# Altium project AUT2606_Semester_Prosjekt.PrjPcb
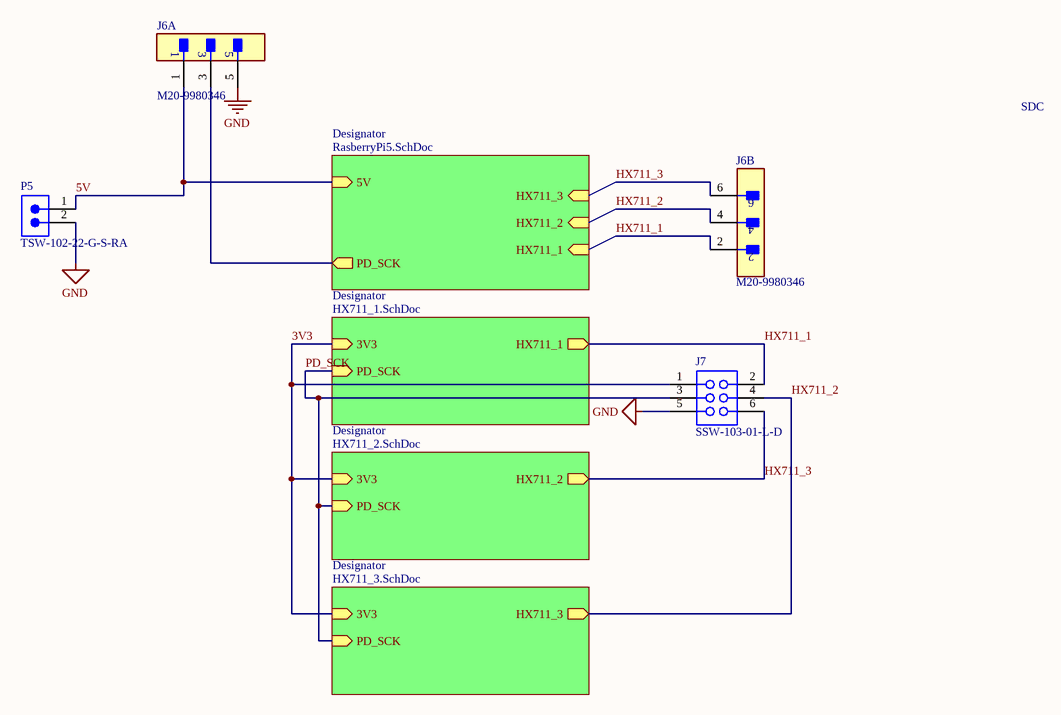
[diagram p0: Main.SchDoc]
5 sheets, 70 parts. Net scope: hierarchical (ports join the sheet entries above them; power ports are global).
Board files: RobotArm_Olav_Nikolai.PcbDoc, RobotArm_HX711_Olav_Nikolai.PcbDoc
Sheets:
  Main.SchDoc
    Designator = RasberryPi5.SchDoc
    Designator = HX711_1.SchDoc
    Designator = HX711_2.SchDoc
    Designator = HX711_3.SchDoc

## Sheet Main.SchDoc
size A4; SheetNumber: 1; SheetTotal: 5

### Parts
J6  M20-9980346  [FP-M20-9980346-MFG]  (parts A,B of 2)
J7  SSW-103-01-L-D  [SMTC-SSW-103-01-X-D]
P5  TSW-102-22-G-S-RA  [SMTC-TSW-102-22-X-S-RA]

### Sub-sheets
Designator = RasberryPi5.SchDoc: 5V (in), HX711_1 (in), HX711_2 (in), HX711_3 (in), PD_SCK (out)
Designator = HX711_1.SchDoc: 3V3 (in), HX711_1 (out), PD_SCK (in)
Designator = HX711_2.SchDoc: 3V3 (in), HX711_2 (out), PD_SCK (in)
Designator = HX711_3.SchDoc: 3V3 (in), HX711_3 (out), PD_SCK (in)

### Nets
GND: J6.5 J7.5 P5.2
3V3: J7.1 ; sheet Designator/3V3, sheet Designator/3V3, sheet Designator/3V3
5V: J6.1 P5.1 ; sheet Designator/5V
HX711_1: J6.2 J7.2 ; sheet Designator/HX711_1, sheet Designator/HX711_1
HX711_2: J6.4 J7.4 ; sheet Designator/HX711_2, sheet Designator/HX711_3
HX711_3: J6.6 J7.6 ; sheet Designator/HX711_3, sheet Designator/HX711_2
PD_SCK: J7.3 ; sheet Designator/PD_SCK, sheet Designator/PD_SCK, sheet Designator/PD_SCK
NetJ6_3: J6.3 ; sheet Designator/PD_SCK

### Notes on the sheet
- SDC

### Library data of the parts
J6 = CMP-2000-06636-2: CONN HEADER VERT 6POS 2.54MM; Manufacturer: Harwin; Current Rating: 3A; Number Of Contacts: 6; Conn Gender: Male; Conn Orientation: Vertical; Device Class L1: Connectors; ComponentLink2Description: Datasheet; Height: 8.99mm; Temperature Range High: +105°C; Contact Material: Tin,Nickel; RoHS: TRUE; Temperature Range Low: -40°C; ComponentLink2URL: https://cdn.harwin.com/pdfs/M20-998.pdf; Digikey Description: CONN HEADER VERT 6POS 2.54MM; Pitch: 2.54mm; Package: M20-9980346; Device Class L2: Headers and Wire Housings; Manufacturer Part Number: M20-9980346; Number Of Rows: 2; Category: Conn; Lead Free: Yes; Mouser Description: 2.54mm (0.1") Pitch DIL Vertical PC Tail Pin Header, 6.1mm mating pin height, tin, 3+3 contacts; Temperature: -40°C to +105°C; Device Class L3: unset; Octopart: https://octopart.com/m20-9980346-harwin-5436545; Automotive: No
J7 = CMP-1023-00330-1: SQ Post Socket, Through-hole, Vertical, -55 to 125 degC, 2.54 mm Pitch, 6-Pin, Female, RoHS; Manufacturer: Samtec; Pitch: 2.54 mm; ComponentLink3Description: Package Specification; DatasheetVersion: F-214; Mounting Technology: Through-hole; RoHS: True; PackageDescription: Assembly, Socket Strip .016 X .031 Tail; Temperature Range: -55 to 125 degC; ComponentLink1Description: Manufacturer URL; ComponentLink2Description: Datasheet; ComponentLink3URL: http://www.samtec.com/documents/webfiles/cpdf/SSW-1XX-XX-XXX-X-XX-XXX-XX-MKT.pdf; ComponentLink2URL: http://www.samtec.com/documents/webfiles/pdf/SSW_TH.PDF; Orientation: Vertical; PartNumber: SSW-103-01-L-D; PackageReference: SSW-103-01-X-D; PackageVersion: CA, 6/1987; ComponentLink1URL: http://www.samtec.com
P5 = CMP-1024-00323-1: 0.025" SQ Post Header, Through-hole, Right Angle, -55 to 125 degC, 2.54 mm Pitch, 2-Pin, Male, RoHS; Manufacturer: Samtec; Pitch: 2.54 mm; ComponentLink2URL: http://www.samtec.com/documents/webfiles/pdf/TSW_TH.PDF; PackageVersion: DM, 8/1988; PartNumber: TSW-102-22-G-S-RA; ComponentLink1URL: http://www.samtec.com; ComponentLink3URL: http://www.samtec.com/documents/webfiles/cpdf/TSW-XXX-XX-XXX-X-XX-XXX-MKT.pdf; Mounting Technology: Through-hole; DatasheetVersion: F-214; Temperature Range: -55 to 125 degC; PackageDescription: .025[0.64] SQ. Post Terminal Strip Assembly; ComponentLink2Description: Datasheet; ComponentLink3Description: Package Specification; PackageReference: TSW-102-22-X-S-RA; ComponentLink1Description: Manufacturer URL; RoHS: True; Orientation: Right Angle

## Sheet RasberryPi5.SchDoc
size A4; SheetNumber: 2; SheetTotal: 5
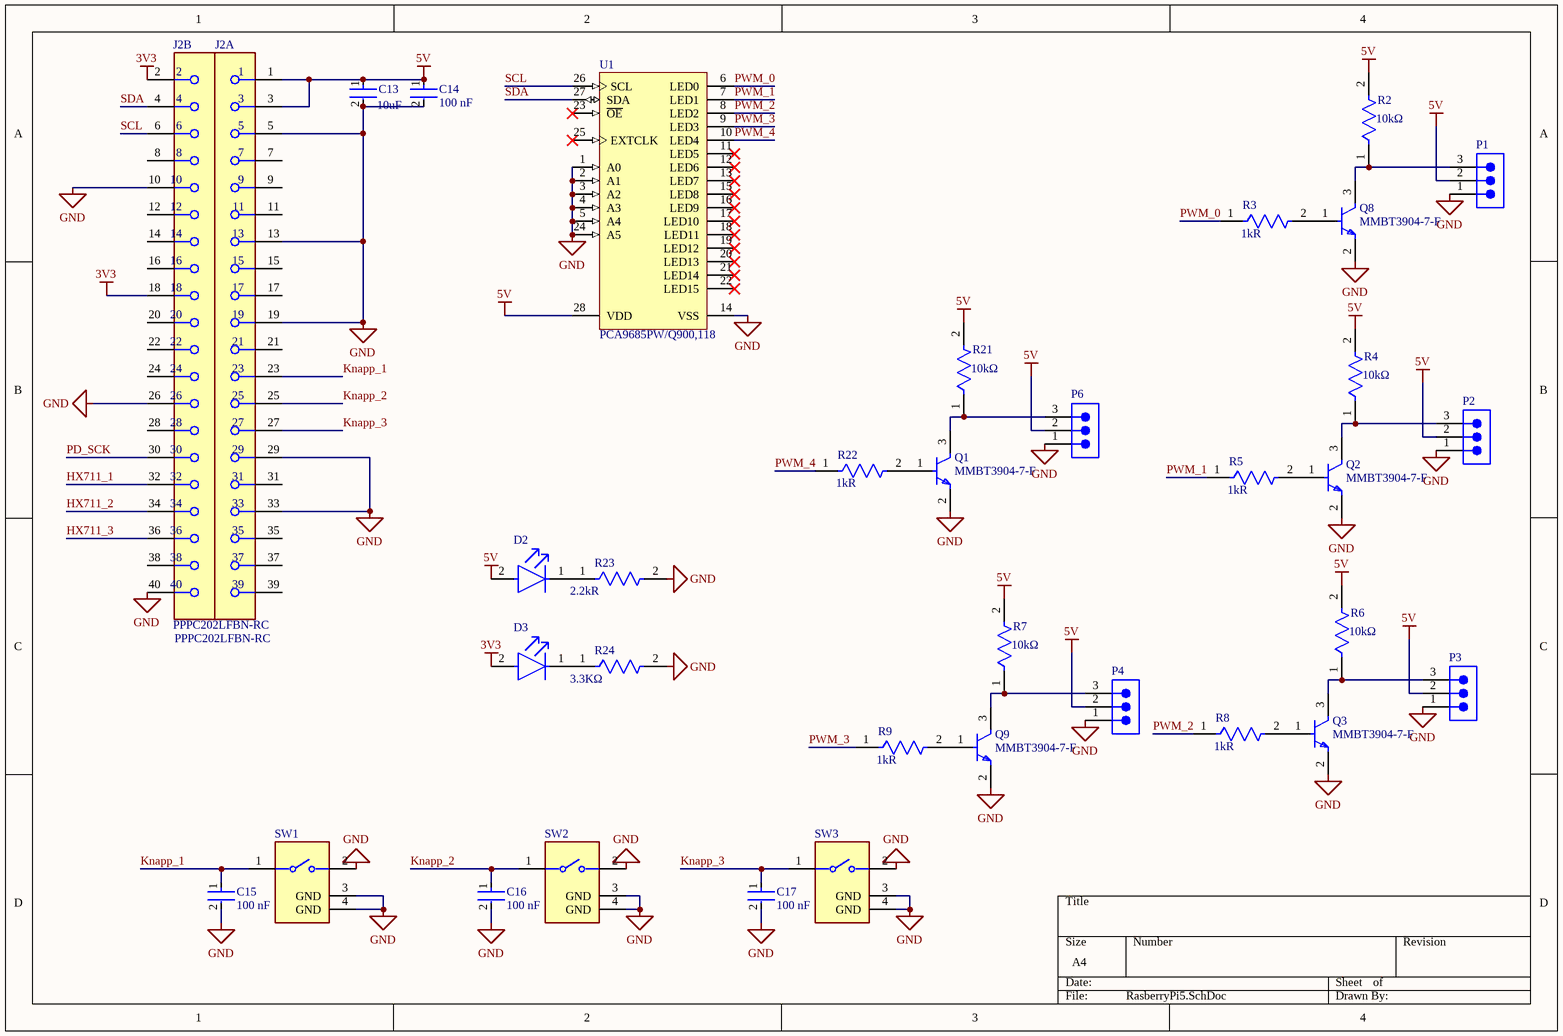
[diagram p1: RasberryPi5.SchDoc]

### Parts
C13  value 10uF  [FP-GRM18-0_15-MFG]  (hidden comment: GRM188R61A106KE69D)
C14  100 nF  [FP-CC0603-DA-MFG]
C15  100 nF  [FP-CC0603-DA-MFG]
C16  100 nF  [FP-CC0603-DA-MFG]
C17  100 nF  [FP-CC0603-DA-MFG]
D2  LTST-C193KGKT-5A  [FP-LTST-C193KGKT-5A-MFG]  (value not drawn)
D3  LTST-C193KGKT-5A  [FP-LTST-C193KGKT-5A-MFG]  (value not drawn)
J2  PPPC202LFBN-RC  [FP-PPPC202LFBN-RC-MFG]  (parts A,B of 2)
P1  MTSW-103-08-L-S-229-RA  [SMTC-MTSW-103-08-X-S-229-RA]  (value not drawn)
P2  MTSW-103-08-L-S-229-RA  [SMTC-MTSW-103-08-X-S-229-RA]  (value not drawn)
P3  MTSW-103-08-L-S-229-RA  [SMTC-MTSW-103-08-X-S-229-RA]  (value not drawn)
P4  MTSW-103-08-L-S-229-RA  [SMTC-MTSW-103-08-X-S-229-RA]  (value not drawn)
P6  MTSW-103-08-L-S-229-RA  [SMTC-MTSW-103-08-X-S-229-RA]  (value not drawn)
Q1  MMBT3904-7-F  [FP-SOT23-IPC_A]
Q2  MMBT3904-7-F  [FP-SOT23-IPC_A]
Q3  MMBT3904-7-F  [FP-SOT23-IPC_A]
Q8  MMBT3904-7-F  [FP-SOT23-IPC_A]
Q9  MMBT3904-7-F  [FP-SOT23-IPC_A]
R2  Resistance: 10kΩ  [FP-SG73P1J-MFG]  (hidden comment: SG73P1JTTD1002F)
R3  Resistance: 1kR  [FP-RK73G1J-IPC_B]  (hidden comment: RK73G1JTTD1001F)
R4  Resistance: 10kΩ  [FP-SG73P1J-MFG]  (hidden comment: SG73P1JTTD1002F)
R5  Resistance: 1kR  [FP-RK73G1J-IPC_B]  (hidden comment: RK73G1JTTD1001F)
R6  Resistance: 10kΩ  [FP-SG73P1J-MFG]  (hidden comment: SG73P1JTTD1002F)
R7  Resistance: 10kΩ  [FP-SG73P1J-MFG]  (hidden comment: SG73P1JTTD1002F)
R8  Resistance: 1kR  [FP-RK73G1J-IPC_B]  (hidden comment: RK73G1JTTD1001F)
R9  Resistance: 1kR  [FP-RK73G1J-IPC_B]  (hidden comment: RK73G1JTTD1001F)
R21  Resistance: 10kΩ  [FP-SG73P1J-MFG]  (hidden comment: SG73P1JTTD1002F)
R22  Resistance: 1kR  [FP-RK73G1J-IPC_B]  (hidden comment: RK73G1JTTD1001F)
R23  Resistance: 2.2kR  [FP-RC1608-IPC_C]  (hidden comment: RC1608J222CS)
R24  value 3.3KΩ  [FP-CRGCQ0603-IPC_C]  (hidden comment: CRGCQ0603J3K3)
SW1  B3F-3122  [FP-B3F-3122-MFG]  (value not drawn)
SW2  B3F-3122  [FP-B3F-3122-MFG]  (value not drawn)
SW3  B3F-3122  [FP-B3F-3122-MFG]  (value not drawn)
U1  PCA9685PW/Q900,118  [SOT361-1_V]  (graphical)

### Nets
3V3: D3.2(A) J2.2 J2.18
5V: C13.1 C14.1 D2.2(A) J2.1 J2.3 P1.2 P2.2 P3.2 P4.2 P6.2 R2.2 R4.2 R6.2 R7.2 R21.2 U1.28(VDD)
GND: C13.2 C14.2 C15.2 C16.2 C17.2 J2.5 J2.10 J2.13 J2.19 J2.26 J2.29 J2.33 J2.40 P1.1 P2.1 P3.1 P4.1 P6.1 Q1.2(E) Q2.2(E) Q3.2(E) Q8.2(E) Q9.2(E) R23.2 R24.2 SW1.2 SW1.3(GND) SW1.4(GND) SW2.2 SW2.3(GND) SW2.4(GND) SW3.2 SW3.3(GND) SW3.4(GND) U1.1(A0) U1.2(A1) U1.3(A2) U1.4(A3) U1.5(A4) U1.14(VSS) U1.24(A5)
HX711_1: J2.32
HX711_2: J2.34
HX711_3: J2.36
Knapp_1: C15.1 J2.23 SW1.1
Knapp_2: C16.1 J2.25 SW2.1
Knapp_3: C17.1 J2.27 SW3.1
PD_SCK: J2.30
PWM_0: R3.1 U1.6(LED0)
PWM_1: R5.1 U1.7(LED1)
PWM_2: R8.1 U1.8(LED2)
PWM_3: R9.1 U1.9(LED3)
PWM_4: R22.1 U1.10(LED4)
SCL: J2.6 U1.26(SCL)
SDA: J2.4 U1.27(SDA)
NetD2_1: D2.1(C) R23.1
NetD3_1: D3.1(C) R24.1
NetP1_3: P1.3 Q8.3(C) R2.1
NetP2_3: P2.3 Q2.3(C) R4.1
NetP3_3: P3.3 Q3.3(C) R6.1
NetP4_3: P4.3 Q9.3(C) R7.1
NetP6_3: P6.3 Q1.3(C) R21.1
NetQ1_1: Q1.1(B) R22.2
NetQ2_1: Q2.1(B) R5.2
NetQ3_1: Q3.1(B) R8.2
NetQ8_1: Q8.1(B) R3.2
NetQ9_1: Q9.1(B) R9.2

Not connected (* = marked no-connect by the designer): J2 7 8 9 11 12 14 15 16 17 20 21 22 24 28 31 35 37 38 39; U1 11(LED5)* 12(LED6)* 13(LED7)* 15(LED8)* 16(LED9)* 17(LED10)* 18(LED11)* 19(LED12)* 20(LED13)* 21(LED14)* 22(LED15)* 23(~{OE})* 25(EXTCLK)*

### Library data of the parts
C13 = CMP-2000-05448-2: CAP CER 10UF 10V X5R 0603; Manufacturer: Murata; Temperature Coefficient: 15%; Material: Ceramic; Tolerance: 10%; Device Class L1: Passive Components; ComponentLink2Description: Datasheet; Height: 0.95mm; Package: GRM18-0.15; Octopart: https://octopart.com/grm188r61a106ke69d-murata-22851381; Manufacturer Part Number: GRM188R61A106KE69D; Digikey Description: CAP CER 10UF 10V X5R 0603; Temperature Range High: +85°C; Temperature Range Low: -55°C; Temperature Characteristic: X5R; Capacitance: 10uF; RoHS: TRUE; Device Class L2: Capacitors; ComponentLink2URL: https://search.murata.co.jp/Ceramy/image/img/A01X/G101/ENG/GRM188R61A106KE69-01A.pdf; Device Class L3: Ceramic Capacitors; Lead Free: Yes; Mouser Description: Multilayer Ceramic Capacitors MLCC - SMD/SMT 0603 10uF 10volts X5R + - 10%; Category: Cap; Voltage Rating: 10V; Temperature: -55°C to +85°C; Automotive: No
C14-C17 = CMP-03422-000081-1: CC0603 100 nF X7R 10.00% 25 V; Manufacturer Part Number: CC0603KPX7R8BB104; Manufacturer: YAGEO; Voltage: 25 V; Material: Ceramic; Tolerance: 0.1; Temperature Coefficient: 15%; Package: CC0603-DA; Capacitance: 100 nF; Device Class L2: Capacitors; Temperature Range High: +125°C; Automotive: No; Temperature Range Low: -55°C; Value: 100 nF; Device Class L1: Passive Components; Height: 0.9mm; RoHS: TRUE; Mouser Description: Multilayer Ceramic Capacitors MLCC - SMD/SMT 100nF 25V X7R 10%; Temperature Characteristic: X7R; Footprint Url: http://www.yageo.com/exep/pages/download/literatures/UPY-C_GEN_24.pdf; Octopart: https://octopart.com/cc0603kpx7r8bb104-yageo-12885111; Category: Cap; ComponentLink2Description: Datasheet; Voltage Rating: 25 V; Temperature: -55°C to +125°C; Device Class L3: Ceramic Capacitors; ComponentLink2URL: http://www.yageo.com/documents/recent/UPY-GPHC_X7R_6.3V-to-50V_18.pdf; Lead Free: Yes
D2 D3 = CMP-2000-06622-2: LED GREEN CLEAR CHIP SMD; Forward Current: 30mA; Power Dissipation: 75mW; Luminous Intensity: 28mcd; Lens Style: Diffused; Lens Color: Colorless; Forward Voltage: 2.3V; Test Current: 5mA; Viewing Angle: 130°; Reverse Voltage: 5V; Dominant Wavelength: 576.5nm; Number of Elements: 1; Number of Pins: 2; Case/Package: 0603; Width: 0.8mm; Radiation Hardening: No; Lead Free: Lead Free; Lens Transparency: Clear; Max Operating Temperature: 85°C; Illumination Color: Green; Color: Green; Packaging: Tape and Reel; Depth: 0.8mm; Length: 1.6mm; Mount: Surface Mount; Case Code (Imperial): 0603; Height: 0.35mm; Min Operating Temperature: -55°C; Package Quantity: 3000; Case Code (Metric): 1608; Power Rating: 75mW; Number of LEDs: 1
J2 = CMP-00595-00271136-1: PPPC202LFBN-RC Female, 40C, Straight, .100"CC; 3.20mm Tail, No Mt.; PBT, Phos Bronze, 105 C; NexarPartId: 271136; Voltage Rating: 250V; Pitch: 2.54mm; Number of Contacts: 40; Current Rating: 3A; Connector Type: Header, Socket; Number of Pins: 2; Min Operating Temperature: -40°C; Color: Black; Contact Plating: Gold; Row Spacing: 2.54mm; Length: 51.3mm; Max Operating Temperature: 105°C; Contact Material: Gold, Nickel; Number of Positions: 40; Width: 5mm; Packaging: Bulk; Housing Material: Plastic; Number of Rows: 2; Termination: Solder; Lead Free: Lead Free; RoHS: Compliant; Height: 8.7mm; Mount: Through Hole
P1-P4 P6 = CMP-1024-00103-1: Modified .025" SQ Post Header, Through-hole, Right Angle, -55 to 125 degC, 2.54 mm Pitch, 3-Pin, Male, RoHS; Manufacturer: Samtec; Pitch: 2.54 mm; DatasheetVersion: F-214; Mounting Technology: Through-hole; PackageDescription: Assembly .025" [.64] SQ Post Terminal Strip; Temperature Range: -55 to 125 degC; PackageVersion: BI, 2/1987; Orientation: Right Angle; ComponentLink3Description: Package Specification; PackageReference: MTSW-103-08-X-S-229-RA; RoHS: True; ComponentLink2URL: http://www.samtec.com/documents/webfiles/pdf/MTSW.PDF; ComponentLink3URL: http://www.samtec.com/documents/webfiles/cpdf/MTSW-XXX-XX-X-X-XXXX-XX-XXX-MKT1.pdf; PartNumber: MTSW-103-08-L-S-229-RA; ComponentLink2Description: Datasheet; ComponentLink1Description: Manufacturer URL; ComponentLink1URL: http://www.samtec.com
Q1-Q3 Q8 Q9 = CMP-2000-04931-2: TRANS NPN 40V 0.2A SMD SOT23-3; Frequency: 300MHz; Power Dissipation: 350mW; Element Configuration: Single; Max Power Dissipation: 300mW; Max Collector Current: 200mA; Collector Emitter Saturation Voltage: 300mV; Number of Elements: 1; hFE Min: 100; Collector Base Voltage (VCBO): 60V; Emitter Base Voltage (VEBO): 6V; Contact Plating: Tin; Package Quantity: 3000; Max Frequency: 300MHz; REACH SVHC: No SVHC; Max Operating Temperature: 150°C; Width: 1.4mm; Collector Emitter Voltage (VCEO): 40V; Voltage Rating (DC): 40V; Radiation Hardening: No; Case/Package: SOT-23; Height: 1mm; Collector Emitter Breakdown Voltage: 40V; Length: 3.05mm; Polarity: NPN; Packaging: Tape and Reel; Number of Pins: 3; Min Operating Temperature: -55°C; Gain Bandwidth Product: 300MHz; Mount: Surface Mount; Weight: 0.000282oz; Continuous Collector Current: 200mA; Transition Frequency: 300MHz; Max Breakdown Voltage: 40V; Lead Free: Lead Free
R2 R4 R6 R7 R21 = CMP-00683-07748074-1: SG73P1JTTD1002F Res Thick Film 0603 10K Ohm 1% 0.2W(1/5W) ±100ppm/C Pad SMD Automotive T/R; Temperature Coefficient: 100ppm/°C; Power Rating: 200mW; Voltage Rating (DC): 50V; Case/Package: 0603; RoHS: Compliant; Termination: SMD/SMT; Case Code (Metric): 1608; Min Operating Temperature: -55°C; Voltage Rating: 50V; NexarPartId: 7748074; Tolerance: 1%; Case Code (Imperial): 0603; Max Operating Temperature: 155°C; Number of Pins: 2
R3 R5 R8 R9 R22 = CMP-04015-096822-1: 1kΩ ±1% 0.1W Chip Resistor 0603 Thick Film AEC-Q200 Qualified; Power Rating: 100mW; Case Code (Metric): 1608; Termination: SMD/SMT; Series: RK73G; Depth: 0.8mm; Packaging: Tape and Reel; Resistor Type: Thick Film; Tolerance: 1%; Construction: Rectangular; Max Operating Temperature: 155°C; RoHS Compliant: Yes; Min Operating Temperature: -55°C; Case/Package: 0603; Case Code (Imperial): 0603; Military Standard: Not; Length: 1.6mm
R23 = CMP-13261-001595-1: Res Thick Film 0603 2.2kΩ 5% 0.1W ±100ppm/°C Molded SMD T/R; Voltage Rating (DC): 50V; Max Power Dissipation: 100mW; Military Standard: Not; Min Operating Temperature: -55°C; Number of Terminations: 2; Contact Plating: Tin; Radiation Hardening: No; Features: Moisture Resistant; Depth: 0.8mm; Max Operating Temperature: 155°C; Width: 0.031inch; Lead Free: Lead Free; Case Code (Metric): 1608; Power Rating: 100mW; Length: 0.063inch; Packaging: Tape and Reel; Case/Package: 0603; Tolerance: 5%; Case Code (Imperial): 0603; Temperature Coefficient: 100ppm/°C; Height: 0.022inch; Composition: Thick Film
R24 = CMP-03211-008656-1: CRGCQ 0603 3K3 5%; Manufacturer: TE Connectivity; Power Rating: 0.1W; Tolerance: 0.05; Temperature Coefficient: ±100ppm/°C; Voltage Rating: 75V; Device Class L2: Resistors; ComponentLink2Description: Datasheet; Temperature Range Low: -55°C; Series: CRGCQ; RoHS: TRUE; Height: 0.55mm; Ambient Temperature Range High: +70°C; Package: CRGCQ0603; Ipc Land Pattern Name: RESC16080X45; Octopart: https://octopart.com/crgcq0603j3k3-te+connectivity-91018121; Digikey Description: CRGCQ 0603 3K3 5%; Temperature Range High: +155°C; Manufacturer Part Number: CRGCQ0603J3K3; Device Class L1: Passive Components; ComponentLink2URL: https://www.te.com/commerce/DocumentDelivery/DDEController?Action=showdoc&DocId=Data+Sheet%7F1773204-3%7F1%7Fpdf%7FEnglish%7FENG_DS_1773204-3_1.pdf%7F4-2176339-809; Device Class L3: Chip SMD Resistors; Category: Res; Temperature: -55°C to +155°C; Composition: Thick Film; Resistance: 3.3KΩ; Lead Free: Yes
SW1-SW3 = CMP-08834-000053-1: SWITCH TACTILE SPST-NO 0.05A 24V; Max Current Rating: 50mA; Actuator Type: Standard; Ratings: IP00; Number of Poles: 1; Mechanical Life: 300000Cycles; Illumination Type: Non-Illuminated; Switch Function: Off-Mom; Actuator Color: Grey; Contact Resistance: 100mR; Throw Configuration: SPST; Actuator Length: 1.6mm; Switch Travel: 0.25mm; Operating Force: 1.47N; Weight: 0.25g; Voltage Rating (DC): 24V; Contact Plating: Gold; RoHS Compliant: Yes; Contact Material: Gold; Radiation Hardening: No; Packaging: Bulk; Height: 7.4mm; Min Operating Temperature: -25°C; Electrical Life: 300000Cycles; Depth: 7.85mm; Max Voltage Rating (DC): 24V; Mount: Through Hole; Width: 6.25mm; Current Rating: 50mA; Lead Free: Lead Free; Max Operating Temperature: 70°C; Series: B3F; Contact Current Rating: 50mA; Package Quantity: 1000; Termination: PC Pins; Orientation: Right Angle; Length: 7.3mm
U1 = CMP-1595-00002-2: 16-Channel, 12-Bit PWM Fm+ I2C-Bus LED Controller, 2.3 to 5.5 V, -40 to 85 degC, 28-Pin TSSOP (SOT361-1), RoHS, Tape and Reel; Supply Voltage Max: 5.5 V; Supply Current Max: 10 mA; Supply Voltage Min: 2.3 V; Frequency: 25000000 Hz; ComponentLink1Description: Manufacturer URL; PackageVersion: 02/2003; PackageDescription: 28-Pin Small Outline Package, Body 9.7 x 4.4 mm, Pitch 0.65 mm; Packing: Tape and Reel; ComponentLink2URL: http://www.nxp.com/documents/data_sheet/PCA9685.pdf; ComponentLink1URL: http://www.nxp.com/; Mounting Technology: Surface Mount; PartNumber: PCA9685; ComponentLink2Description: Datasheet; Temperature Min: -40 degC; ComponentLink3URL: http://www.nxp.com/documents/outline_drawing/sot361-1_po.pdf; Temperature Max: 85 degC; DatasheetVersion: Rev. 4; ComponentLink3Description: Package Specification; RoHS: TRUE; Code_JEDEC: MO-153

## Sheet HX711_1.SchDoc
size A4; SheetNumber: 3; SheetTotal: 5
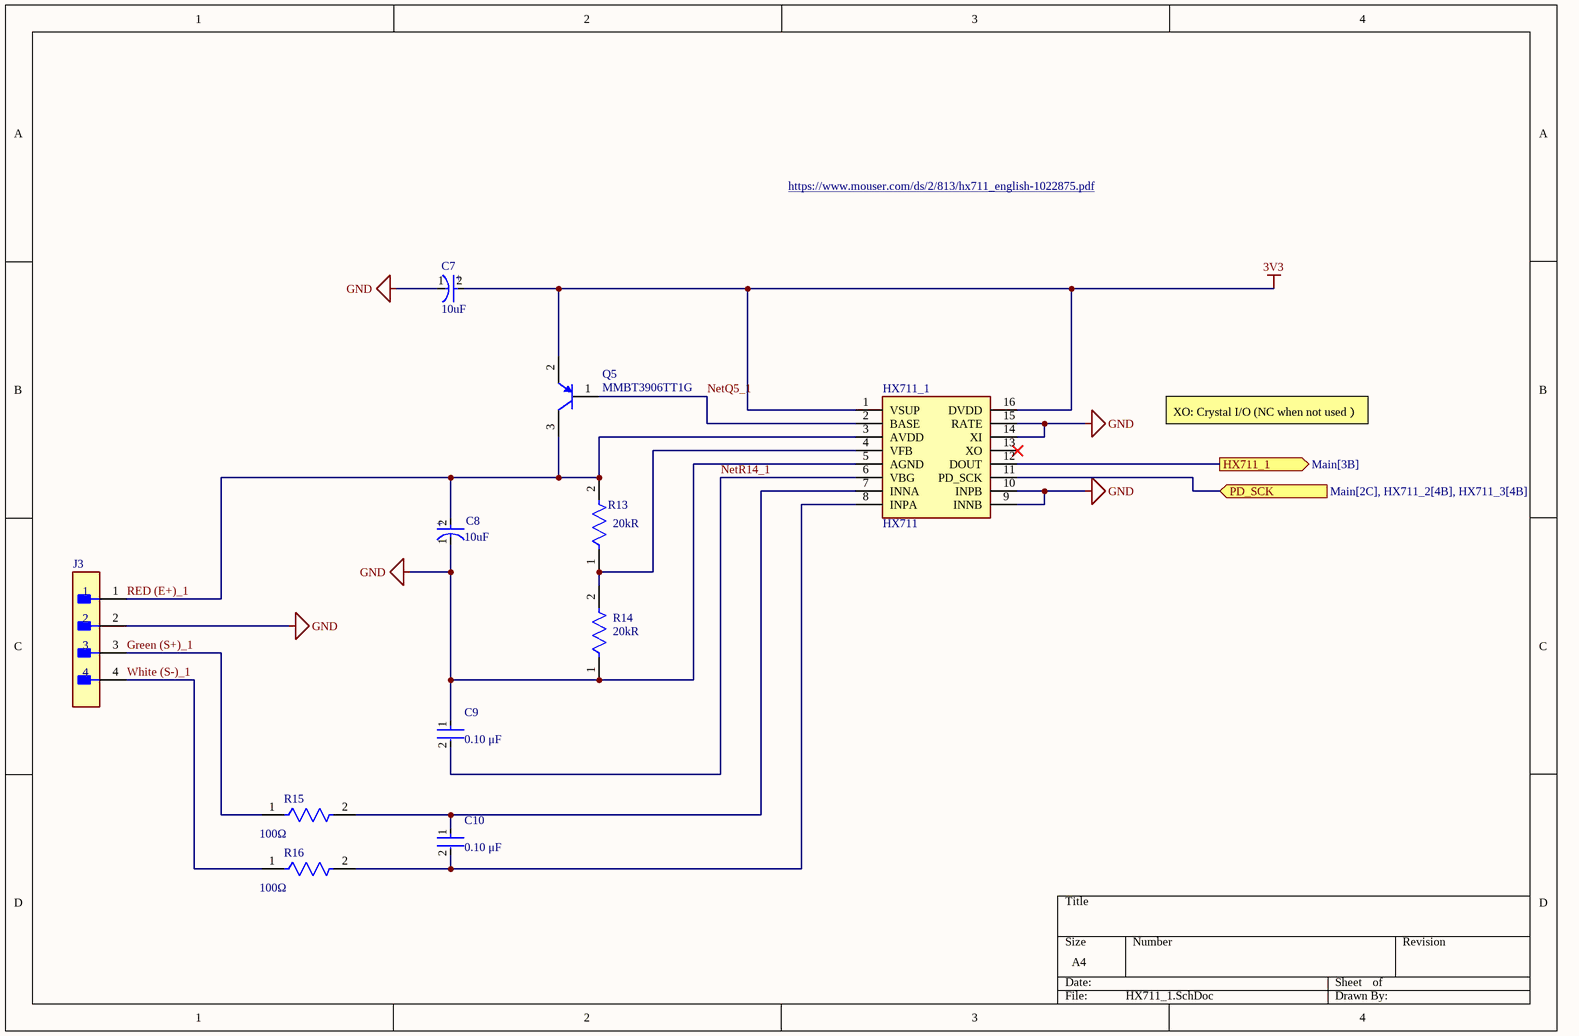
[diagram p2: HX711_1.SchDoc]

### Parts
C7  Capacitance: 10uF  [FP-EDK9B-MFG]  (hidden comment: EDK106M035A9BAA)
C8  Capacitance: 10uF  [FP-EDK9B-MFG]  (hidden comment: EDK106M035A9BAA)
C9  value 0.10 μF  [FP-C0603C-CF-MFG]  (hidden comment: C0603C104K3RAC7411)
C10  value 0.10 μF  [FP-C0603C-CF-MFG]  (hidden comment: C0603C104K3RAC7411)
HX711_1  HX711  [SOIC127P600X160-16N]  (graphical)
J3  TSW-104-23-T-S  [FP-TSW-104-23-T-S-MFG]  (value not drawn)
Q5  MMBT3906TT1G  [ONSC-SC-75-3-463-01_V]
R13  Resistance: 20kR  [FP-CRCW0603-HPe3-MFG]  (hidden comment: CRCW060320K0FKEAHP)
R14  Resistance: 20kR  [FP-CRCW0603-HPe3-MFG]  (hidden comment: CRCW060320K0FKEAHP)
R15  value 100Ω  [FP-RT0603-MFG]  (hidden comment: RT0603FRE07100RL)
R16  value 100Ω  [FP-RT0603-MFG]  (hidden comment: RT0603FRE07100RL)

### Ports
HX711_1 (out, see Main[3B]), PD_SCK (in, see Main[2C], HX711_2[4B], HX711_3[4B])

### Nets
3V3: C7.2(A) HX711_1.1(VSUP) HX711_1.16(DVDD) Q5.2(E)
GND: C7.1(C) C8.1(C) C9.1 HX711_1.5(AGND) HX711_1.9(INNB) HX711_1.10(INPB) HX711_1.14(XI) HX711_1.15(RATE) J3.2 R14.1
Green (S+)_1: J3.3 R15.1
HX711_1: HX711_1.12(DOUT) ; port HX711_1
NetQ5_1: HX711_1.2(BASE) Q5.1(B)
NetR14_1: C9.2 HX711_1.6(VBG)
PD_SCK: HX711_1.11(PD_SCK) ; port PD_SCK
RED (E+)_1: C8.2(A) HX711_1.3(AVDD) J3.1 Q5.3(C) R13.2
White (S-)_1: J3.4 R16.1
NetC10_1: C10.1 HX711_1.7(INNA) R15.2
NetC10_2: C10.2 HX711_1.8(INPA) R16.2
NetHX711_1_4: HX711_1.4(VFB) R13.1 R14.2

Not connected (* = marked no-connect by the designer): HX711_1 13(XO)*

### Notes on the sheet
- https://www.mouser.com/ds/2/813/hx711_english-1022875.pdf
- XO: Crystal I/O (NC when not used）
- (in symbol CMP-03015-000003-1) +

### Library data of the parts
C7 C8 = CMP-03015-000003-1: CAP ALUM 10UF 20% 35V SMD; Manufacturer: Kemet; Dissipation Factor: 16%; Material: Aluminum; Leakage Current: 3.5uA; Ripple Current: 24mA; Life: 2000Hours; Device Class L2: Capacitors; Device Class L1: Passive Components; Device Class L3: Aluminum Electrolytic Capacitors; RoHS: TRUE; Digikey Description: CAP ALUM 10UF 20% 35V SMD; ComponentLink2URL: https://content.kemet.com/datasheets/KEM_A4001_EDK.pdf; Temperature: -40°C to +85°C; Category: Cap; Voltage Rating: 35V; Value: 10uF; Temperature Range Low: -40°C; Lead Free: Yes; Octopart: https://octopart.com/edk106m035a9baa-kemet-26722193; Footprint Url: http://www.kemet.com/Lists/FileStore/smd_radial_ordering_codes_tech.pdf; Manufacturer Part Number: EDK106M035A9BAA; Height: 5.65mm; Package: EDK9B; Tolerance: 20%; Temperature Range High: +85°C; Automotive: No; ComponentLink2Description: Datasheet
C9 C10 = CMP-2006-02291-2: CAP CER 0.1UF 25V X7R 0603; Manufacturer: KEMET; Material: Ceramic; Temperature Coefficient: 30ppm/°C; Automotive Grade: Grade 1; Tolerance: 0.1; Device Class L2: Capacitors; ComponentLink2URL: https://api.kemet.com/component-edge/download/datasheet/C0603C100J5GACAUTO.pdf; Device Class L3: Ceramic Capacitors; Capacitance: 0.10 μF; Octopart: https://octopart.com/c0603c104k3rac7411-kemet-9138804; Lead Free: Yes; Automotive: Yes; ComponentLink2Description: Datasheet; Temperature Characteristic: X7R; Height: 0.87mm; Temperature: -55°C to +125°C; Temperature Range High: +125°C; Temperature Range Low: -55°C; Category: Cap; Package: C0603C-CF; Device Class L1: Passive Components; RoHS: TRUE; Digikey Description: CAP CER 0.1UF 25V X7R 0603; Voltage Rating: 25 V; Mouser Description: Multilayer Ceramic Capacitors MLCC - SMD/SMT 25volts 0.1uF X7R 10%; Manufacturer Part Number: C0603C104K3RAC7411
HX711_1 = HX711: Integrated Circuit; Manufacturer_Name: AVIA; Datasheet Link: https://cdn.sparkfun.com/datasheets/Sensors/ForceFlex/hx711_english.pdf; Height: 1.6mm; Manufacturer_Part_Number: HX711
J3 = CMP-02766-001388-1: CONN HEADER VERT 4POS 2.54MM; Number of Contacts: 4; Gender: Male; Connector Type: Male Pin; Max Voltage Rating (AC): 550V; Max Current Rating: 7.6A; Radiation Hardening: No; Lead Free: Lead Free; RoHS Compliant: Yes; Contact Material: Bronze; Number of Positions: 4; Housing Color: Black; Min Operating Temperature: -55°C; Mount: Through Hole; Number of Rows: 1; Orientation: Straight; Contact Mating Length: 0.23inch; Contact Type: Male Pin; REACH SVHC: No SVHC; Max Operating Temperature: 105°C; Color: Black; Pitch: 2.54mm; Length: 10.16mm; Series: TSW; Packaging: Bulk; Contact Plating: Tin; Package Quantity: 1; Termination: Solder; Housing Material: Polyester; Width: 2.54mm; Depth: 2.54mm
Q5 = CMP-1048-00413-1: General Purpose Transistor, PNP Silicon, 3-Pin SC-75, Pb-Free, Tape and Reel; Manufacturer: On Semiconductor; fT Min (MHz): 250; IC Continuous (A): -0.2; ComponentLink1URL: http://www.onsemi.com/; ComponentLink3Description: Package Specification; PackageDescription: 3-Pin Small Outline Transistor, Body 1.6 x 0.8 mm, Pitch 0.5 mm; ComponentLink1Description: Manufacturer URL; ComponentLink2Description: Datasheet; RoHS: TRUE; Packing: Tape and Reel; PackageVersion: Rev. F, 07/2005; PartNumber: MMBT3906TT1G; ComponentLink3URL: http://www.onsemi.com/pub_link/Collateral/463-01.PDF; PackageReference: SC-75-3-463-01; Mounting Technology: Surface Mount; Polarity: PNP; DatasheetVersion: Rev. 1; ComponentLink2URL: http://www.onsemi.cn/pub_link/Collateral/MMBT3906TT1-D.PDF
R13 R14 = CMP-02407-007301-1: RES Thick Film, 20kΩ, 1%, 0.33W, 100ppm/°C, 0603; Voltage Rating: 75V; Max Power Dissipation: 250mW; Weight: 7.1E-05oz; Radiation Hardening: No; Length: 1.6mm; Case/Package: 0603; Width: 0.033inch; Mount: Surface Mount; Height: 0.45mm; Composition: Thick Film; Depth: 0.85mm; Min Operating Temperature: -55°C; Contact Plating: Tin; Termination: SMD/SMT; Case Code (Metric): 1608; Tolerance: 1%; Number of Terminations: 2; Max Operating Temperature: 155°C; Case Code (Imperial): 0603; Power Rating: 250mW; Package Quantity: 10; Temperature Coefficient: 100ppm/°C; Lead Free: Lead Free; Features: Automotive AEC-Q200; Packaging: Tape and Reel
R15 R16 = CMP-03412-022806-1: RES SMD 100 OHM 1% 1/10W 0603; Manufacturer: Yageo; Power Rating: 0.1W; Voltage Rating: 75V; Temperature Coefficient: 50 ppm/°C; Tolerance: 0.01; Manufacturer Part Number: RT0603FRE07100RL; Mouser Description: Thin Film Resistors - SMD 1/10W 100 ohm 1% 50ppm; Ipc Land Pattern Name: RESC16080X45; Height: 0.55mm; Category: Res; Temperature Range Low: -55°C; Lead Free: Yes; Automotive: No; Device Class L3: Chip SMD Resistors; ComponentLink2Description: Datasheet; Device Class L2: Resistors; RoHS: TRUE; Footprint Url: http://www.yageo.com/exep/pages/download/literatures/PYu-R_Mount_10.pdf; Digikey Description: RES SMD 100 OHM 1% 1/10W 0603; Temperature Range High: +155°C; Resistance: 100Ω; Package: RT0603; Device Class L1: Passive Components; Series: RT; Temperature: -55°C to +155°C; Octopart: https://octopart.com/rt0603fre07100rl-yageo-39792638; Composition: Thin Film; ComponentLink2URL: http://www.yageo.com/documents/recent/PYu-RT_1-to-0.01_RoHS_L_9.pdf

## Sheet HX711_2.SchDoc
size A4; SheetNumber: 4; SheetTotal: 5
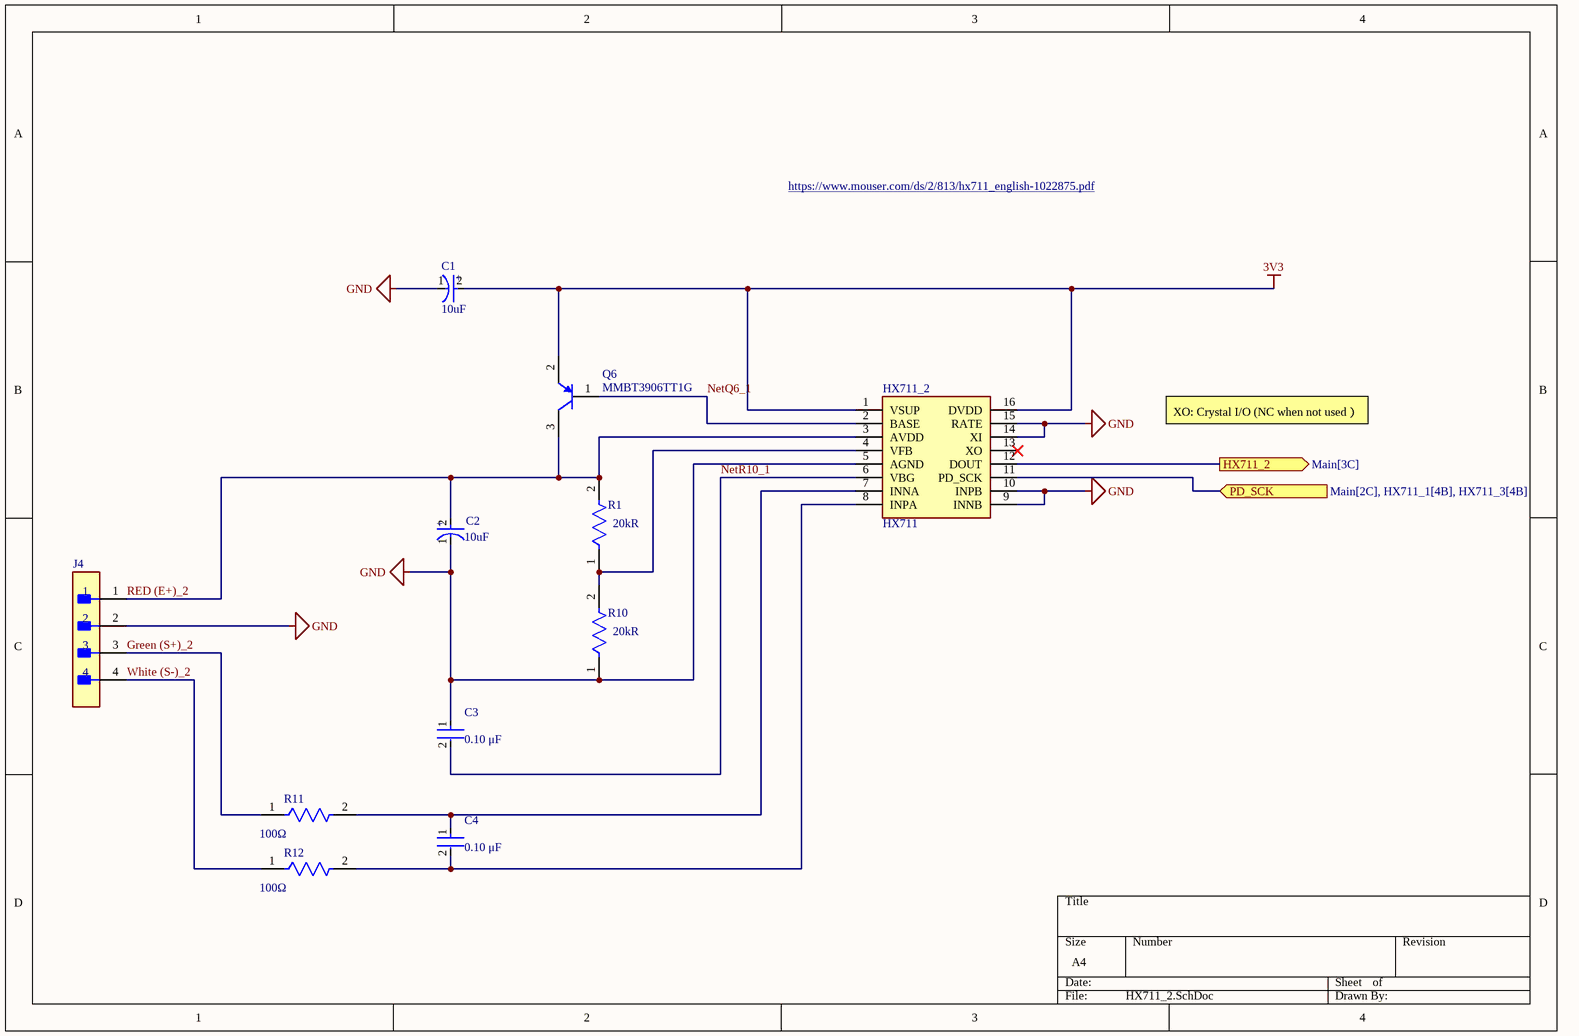
[diagram p3: HX711_2.SchDoc]

### Parts
C1  Capacitance: 10uF  [FP-EDK9B-MFG]  (hidden comment: EDK106M035A9BAA)
C2  Capacitance: 10uF  [FP-EDK9B-MFG]  (hidden comment: EDK106M035A9BAA)
C3  value 0.10 μF  [FP-C0603C-CF-MFG]  (hidden comment: C0603C104K3RAC7411)
C4  value 0.10 μF  [FP-C0603C-CF-MFG]  (hidden comment: C0603C104K3RAC7411)
HX711_2  HX711  [SOIC127P600X160-16N]  (graphical)
J4  TSW-104-23-T-S  [FP-TSW-104-23-T-S-MFG]  (value not drawn)
Q6  MMBT3906TT1G  [ONSC-SC-75-3-463-01_V]
R1  Resistance: 20kR  [FP-CRCW0603-HPe3-MFG]  (hidden comment: CRCW060320K0FKEAHP)
R10  Resistance: 20kR  [FP-CRCW0603-HPe3-MFG]  (hidden comment: CRCW060320K0FKEAHP)
R11  value 100Ω  [FP-RT0603-MFG]  (hidden comment: RT0603FRE07100RL)
R12  value 100Ω  [FP-RT0603-MFG]  (hidden comment: RT0603FRE07100RL)

### Ports
HX711_2 (out, see Main[3C]), PD_SCK (in, see Main[2C], HX711_1[4B], HX711_3[4B])

### Nets
3V3: C1.2(A) HX711_2.1(VSUP) HX711_2.16(DVDD) Q6.2(E)
GND: C1.1(C) C2.1(C) C3.1 HX711_2.5(AGND) HX711_2.9(INNB) HX711_2.10(INPB) HX711_2.14(XI) HX711_2.15(RATE) J4.2 R10.1
Green (S+)_2: J4.3 R11.1
HX711_3: HX711_2.12(DOUT) ; port HX711_2
NetQ6_1: HX711_2.2(BASE) Q6.1(B)
NetR10_1: C3.2 HX711_2.6(VBG)
PD_SCK: HX711_2.11(PD_SCK) ; port PD_SCK
RED (E+)_2: C2.2(A) HX711_2.3(AVDD) J4.1 Q6.3(C) R1.2
White (S-)_2: J4.4 R12.1
NetC4_1: C4.1 HX711_2.7(INNA) R11.2
NetC4_2: C4.2 HX711_2.8(INPA) R12.2
NetHX711_2_4: HX711_2.4(VFB) R1.1 R10.2

Not connected (* = marked no-connect by the designer): HX711_2 13(XO)*

### Notes on the sheet
- https://www.mouser.com/ds/2/813/hx711_english-1022875.pdf
- XO: Crystal I/O (NC when not used）
- (in symbol CMP-03015-000003-1) +

### Library data of the parts
C1 C2 = CMP-03015-000003-1: as C7 on sheet HX711_1; Device Class L2: Capacitors; Device Class L1: Passive Components; Device Class L3: Aluminum Electrolytic Capacitors; RoHS: TRUE; Digikey Description: CAP ALUM 10UF 20% 35V SMD; ComponentLink2URL: https://content.kemet.com/datasheets/KEM_A4001_EDK.pdf; Temperature: -40°C to +85°C; Category: Cap; Voltage Rating: 35V; Value: 10uF; Temperature Range Low: -40°C; Lead Free: Yes; Octopart: https://octopart.com/edk106m035a9baa-kemet-26722193; Footprint Url: http://www.kemet.com/Lists/FileStore/smd_radial_ordering_codes_tech.pdf; Manufacturer Part Number: EDK106M035A9BAA; Height: 5.65mm; Package: EDK9B; Tolerance: 20%; Temperature Range High: +85°C; Automotive: No; ComponentLink2Description: Datasheet
C3 C4 = CMP-2006-02291-2: as C9 on sheet HX711_1; Device Class L2: Capacitors; ComponentLink2URL: https://api.kemet.com/component-edge/download/datasheet/C0603C100J5GACAUTO.pdf; Device Class L3: Ceramic Capacitors; Capacitance: 0.10 μF; Octopart: https://octopart.com/c0603c104k3rac7411-kemet-9138804; Lead Free: Yes; Automotive: Yes; ComponentLink2Description: Datasheet; Temperature Characteristic: X7R; Height: 0.87mm; Temperature: -55°C to +125°C; Temperature Range High: +125°C; Temperature Range Low: -55°C; Category: Cap; Package: C0603C-CF; Device Class L1: Passive Components; RoHS: TRUE; Digikey Description: CAP CER 0.1UF 25V X7R 0603; Voltage Rating: 25 V; Mouser Description: Multilayer Ceramic Capacitors MLCC - SMD/SMT 25volts 0.1uF X7R 10%; Manufacturer Part Number: C0603C104K3RAC7411
HX711_2 = HX711: as HX711_1 on sheet HX711_1; Datasheet Link: https://cdn.sparkfun.com/datasheets/Sensors/ForceFlex/hx711_english.pdf; Height: 1.6mm; Manufacturer_Part_Number: HX711
J4 = CMP-02766-001388-1: as J3 on sheet HX711_1; Radiation Hardening: No; Lead Free: Lead Free; RoHS Compliant: Yes; Contact Material: Bronze; Number of Positions: 4; Housing Color: Black; Min Operating Temperature: -55°C; Mount: Through Hole; Number of Rows: 1; Orientation: Straight; Contact Mating Length: 0.23inch; Contact Type: Male Pin; REACH SVHC: No SVHC; Max Operating Temperature: 105°C; Color: Black; Pitch: 2.54mm; Length: 10.16mm; Series: TSW; Packaging: Bulk; Contact Plating: Tin; Package Quantity: 1; Termination: Solder; Housing Material: Polyester; Width: 2.54mm; Depth: 2.54mm
Q6 = CMP-1048-00413-1: as Q5 on sheet HX711_1; ComponentLink1URL: http://www.onsemi.com/; ComponentLink3Description: Package Specification; PackageDescription: 3-Pin Small Outline Transistor, Body 1.6 x 0.8 mm, Pitch 0.5 mm; ComponentLink1Description: Manufacturer URL; ComponentLink2Description: Datasheet; RoHS: TRUE; Packing: Tape and Reel; PackageVersion: Rev. F, 07/2005; PartNumber: MMBT3906TT1G; ComponentLink3URL: http://www.onsemi.com/pub_link/Collateral/463-01.PDF; PackageReference: SC-75-3-463-01; Mounting Technology: Surface Mount; Polarity: PNP; DatasheetVersion: Rev. 1; ComponentLink2URL: http://www.onsemi.cn/pub_link/Collateral/MMBT3906TT1-D.PDF
R1 R10 = CMP-02407-007301-1: as R13 on sheet HX711_1; Weight: 7.1E-05oz; Radiation Hardening: No; Length: 1.6mm; Case/Package: 0603; Width: 0.033inch; Mount: Surface Mount; Height: 0.45mm; Composition: Thick Film; Depth: 0.85mm; Min Operating Temperature: -55°C; Contact Plating: Tin; Termination: SMD/SMT; Case Code (Metric): 1608; Tolerance: 1%; Number of Terminations: 2; Max Operating Temperature: 155°C; Case Code (Imperial): 0603; Power Rating: 250mW; Package Quantity: 10; Temperature Coefficient: 100ppm/°C; Lead Free: Lead Free; Features: Automotive AEC-Q200; Packaging: Tape and Reel
R11 R12 = CMP-03412-022806-1: as R15 on sheet HX711_1; Manufacturer Part Number: RT0603FRE07100RL; Mouser Description: Thin Film Resistors - SMD 1/10W 100 ohm 1% 50ppm; Ipc Land Pattern Name: RESC16080X45; Height: 0.55mm; Category: Res; Temperature Range Low: -55°C; Lead Free: Yes; Automotive: No; Device Class L3: Chip SMD Resistors; ComponentLink2Description: Datasheet; Device Class L2: Resistors; RoHS: TRUE; Footprint Url: http://www.yageo.com/exep/pages/download/literatures/PYu-R_Mount_10.pdf; Digikey Description: RES SMD 100 OHM 1% 1/10W 0603; Temperature Range High: +155°C; Resistance: 100Ω; Package: RT0603; Device Class L1: Passive Components; Series: RT; Temperature: -55°C to +155°C; Octopart: https://octopart.com/rt0603fre07100rl-yageo-39792638; Composition: Thin Film; ComponentLink2URL: http://www.yageo.com/documents/recent/PYu-RT_1-to-0.01_RoHS_L_9.pdf

## Sheet HX711_3.SchDoc
size A4; SheetNumber: 5; SheetTotal: 5
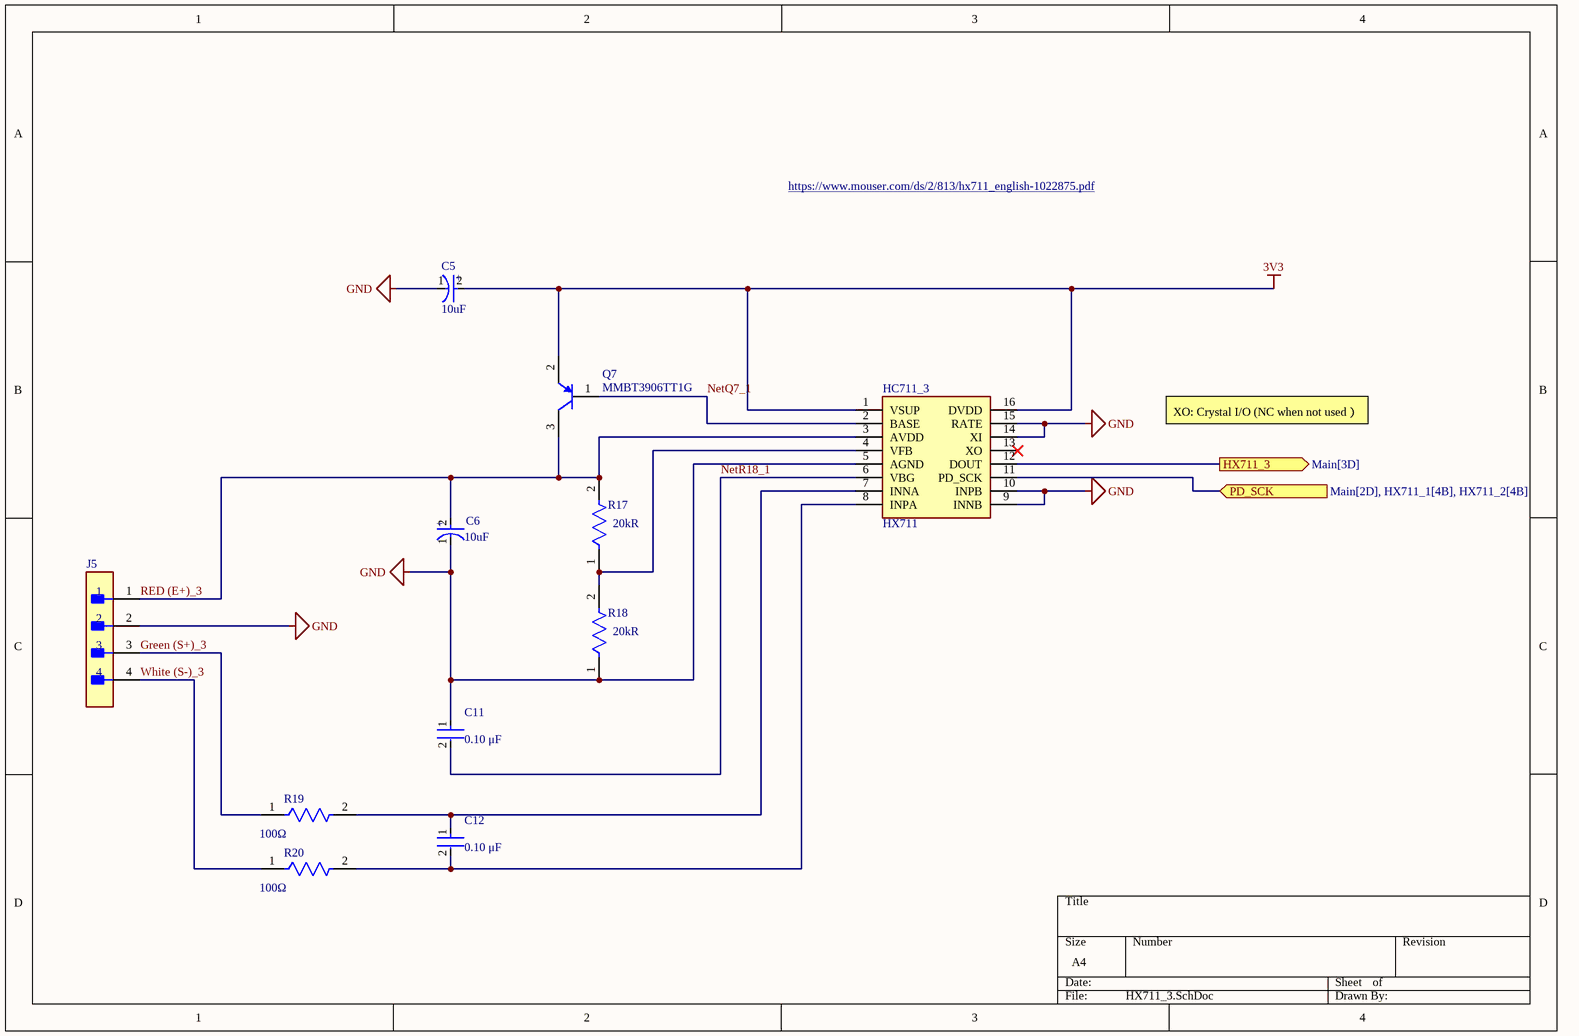
[diagram p4: HX711_3.SchDoc]

### Parts
C5  Capacitance: 10uF  [FP-EDK9B-MFG]  (hidden comment: EDK106M035A9BAA)
C6  Capacitance: 10uF  [FP-EDK9B-MFG]  (hidden comment: EDK106M035A9BAA)
C11  value 0.10 μF  [FP-C0603C-CF-MFG]  (hidden comment: C0603C104K3RAC7411)
C12  value 0.10 μF  [FP-C0603C-CF-MFG]  (hidden comment: C0603C104K3RAC7411)
HC711_3  HX711  [SOIC127P600X160-16N]  (graphical)
J5  TSW-104-23-T-S  [FP-TSW-104-23-T-S-MFG]  (value not drawn)
Q7  MMBT3906TT1G  [ONSC-SC-75-3-463-01_V]
R17  Resistance: 20kR  [FP-CRCW0603-HPe3-MFG]  (hidden comment: CRCW060320K0FKEAHP)
R18  Resistance: 20kR  [FP-CRCW0603-HPe3-MFG]  (hidden comment: CRCW060320K0FKEAHP)
R19  value 100Ω  [FP-RT0603-MFG]  (hidden comment: RT0603FRE07100RL)
R20  value 100Ω  [FP-RT0603-MFG]  (hidden comment: RT0603FRE07100RL)

### Ports
HX711_3 (out, see Main[3D]), PD_SCK (in, see Main[2D], HX711_1[4B], HX711_2[4B])

### Nets
3V3: C5.2(A) HC711_3.1(VSUP) HC711_3.16(DVDD) Q7.2(E)
GND: C5.1(C) C6.1(C) C11.1 HC711_3.5(AGND) HC711_3.9(INNB) HC711_3.10(INPB) HC711_3.14(XI) HC711_3.15(RATE) J5.2 R18.1
Green (S+)_3: J5.3 R19.1
HX711_2: HC711_3.12(DOUT) ; port HX711_3
NetQ7_1: HC711_3.2(BASE) Q7.1(B)
NetR18_1: C11.2 HC711_3.6(VBG)
PD_SCK: HC711_3.11(PD_SCK) ; port PD_SCK
RED (E+)_3: C6.2(A) HC711_3.3(AVDD) J5.1 Q7.3(C) R17.2
White (S-)_3: J5.4 R20.1
NetC12_1: C12.1 HC711_3.7(INNA) R19.2
NetC12_2: C12.2 HC711_3.8(INPA) R20.2
NetHC711_3_4: HC711_3.4(VFB) R17.1 R18.2

Not connected (* = marked no-connect by the designer): HC711_3 13(XO)*

### Notes on the sheet
- https://www.mouser.com/ds/2/813/hx711_english-1022875.pdf
- XO: Crystal I/O (NC when not used）
- (in symbol CMP-03015-000003-1) +

### Library data of the parts
C5 C6 = CMP-03015-000003-1: as C7 on sheet HX711_1; Device Class L2: Capacitors; Device Class L1: Passive Components; Device Class L3: Aluminum Electrolytic Capacitors; RoHS: TRUE; Digikey Description: CAP ALUM 10UF 20% 35V SMD; ComponentLink2URL: https://content.kemet.com/datasheets/KEM_A4001_EDK.pdf; Temperature: -40°C to +85°C; Category: Cap; Voltage Rating: 35V; Value: 10uF; Temperature Range Low: -40°C; Lead Free: Yes; Octopart: https://octopart.com/edk106m035a9baa-kemet-26722193; Footprint Url: http://www.kemet.com/Lists/FileStore/smd_radial_ordering_codes_tech.pdf; Manufacturer Part Number: EDK106M035A9BAA; Height: 5.65mm; Package: EDK9B; Tolerance: 20%; Temperature Range High: +85°C; Automotive: No; ComponentLink2Description: Datasheet
C11 C12 = CMP-2006-02291-2: as C9 on sheet HX711_1; Device Class L2: Capacitors; ComponentLink2URL: https://api.kemet.com/component-edge/download/datasheet/C0603C100J5GACAUTO.pdf; Device Class L3: Ceramic Capacitors; Capacitance: 0.10 μF; Octopart: https://octopart.com/c0603c104k3rac7411-kemet-9138804; Lead Free: Yes; Automotive: Yes; ComponentLink2Description: Datasheet; Temperature Characteristic: X7R; Height: 0.87mm; Temperature: -55°C to +125°C; Temperature Range High: +125°C; Temperature Range Low: -55°C; Category: Cap; Package: C0603C-CF; Device Class L1: Passive Components; RoHS: TRUE; Digikey Description: CAP CER 0.1UF 25V X7R 0603; Voltage Rating: 25 V; Mouser Description: Multilayer Ceramic Capacitors MLCC - SMD/SMT 25volts 0.1uF X7R 10%; Manufacturer Part Number: C0603C104K3RAC7411
HC711_3 = HX711: as HX711_1 on sheet HX711_1; Datasheet Link: https://cdn.sparkfun.com/datasheets/Sensors/ForceFlex/hx711_english.pdf; Height: 1.6mm; Manufacturer_Part_Number: HX711
J5 = CMP-02766-001388-1: as J3 on sheet HX711_1; Radiation Hardening: No; Lead Free: Lead Free; RoHS Compliant: Yes; Contact Material: Bronze; Number of Positions: 4; Housing Color: Black; Min Operating Temperature: -55°C; Mount: Through Hole; Number of Rows: 1; Orientation: Straight; Contact Mating Length: 0.23inch; Contact Type: Male Pin; REACH SVHC: No SVHC; Max Operating Temperature: 105°C; Color: Black; Pitch: 2.54mm; Length: 10.16mm; Series: TSW; Packaging: Bulk; Contact Plating: Tin; Package Quantity: 1; Termination: Solder; Housing Material: Polyester; Width: 2.54mm; Depth: 2.54mm
Q7 = CMP-1048-00413-1: as Q5 on sheet HX711_1; ComponentLink1URL: http://www.onsemi.com/; ComponentLink3Description: Package Specification; PackageDescription: 3-Pin Small Outline Transistor, Body 1.6 x 0.8 mm, Pitch 0.5 mm; ComponentLink1Description: Manufacturer URL; ComponentLink2Description: Datasheet; RoHS: TRUE; Packing: Tape and Reel; PackageVersion: Rev. F, 07/2005; PartNumber: MMBT3906TT1G; ComponentLink3URL: http://www.onsemi.com/pub_link/Collateral/463-01.PDF; PackageReference: SC-75-3-463-01; Mounting Technology: Surface Mount; Polarity: PNP; DatasheetVersion: Rev. 1; ComponentLink2URL: http://www.onsemi.cn/pub_link/Collateral/MMBT3906TT1-D.PDF
R17 R18 = CMP-02407-007301-1: as R13 on sheet HX711_1; Weight: 7.1E-05oz; Radiation Hardening: No; Length: 1.6mm; Case/Package: 0603; Width: 0.033inch; Mount: Surface Mount; Height: 0.45mm; Composition: Thick Film; Depth: 0.85mm; Min Operating Temperature: -55°C; Contact Plating: Tin; Termination: SMD/SMT; Case Code (Metric): 1608; Tolerance: 1%; Number of Terminations: 2; Max Operating Temperature: 155°C; Case Code (Imperial): 0603; Power Rating: 250mW; Package Quantity: 10; Temperature Coefficient: 100ppm/°C; Lead Free: Lead Free; Features: Automotive AEC-Q200; Packaging: Tape and Reel
R19 R20 = CMP-03412-022806-1: as R15 on sheet HX711_1; Manufacturer Part Number: RT0603FRE07100RL; Mouser Description: Thin Film Resistors - SMD 1/10W 100 ohm 1% 50ppm; Ipc Land Pattern Name: RESC16080X45; Height: 0.55mm; Category: Res; Temperature Range Low: -55°C; Lead Free: Yes; Automotive: No; Device Class L3: Chip SMD Resistors; ComponentLink2Description: Datasheet; Device Class L2: Resistors; RoHS: TRUE; Footprint Url: http://www.yageo.com/exep/pages/download/literatures/PYu-R_Mount_10.pdf; Digikey Description: RES SMD 100 OHM 1% 1/10W 0603; Temperature Range High: +155°C; Resistance: 100Ω; Package: RT0603; Device Class L1: Passive Components; Series: RT; Temperature: -55°C to +155°C; Octopart: https://octopart.com/rt0603fre07100rl-yageo-39792638; Composition: Thin Film; ComponentLink2URL: http://www.yageo.com/documents/recent/PYu-RT_1-to-0.01_RoHS_L_9.pdf

## Nets that join several sheets
3V3: RasberryPi5 (D3.2 J2.2 J2.18), HX711_1 (C7.2 HX711_1.1 HX711_1.16 Q5.2), HX711_2 (C1.2 HX711_2.1 HX711_2.16 Q6.2), HX711_3 (C5.2 HC711_3.1 HC711_3.16 Q7.2)
GND: Main (J6.5 J7.5 P5.2), RasberryPi5 (41 pins), HX711_1 (10 pins), HX711_2 (10 pins), HX711_3 (10 pins)
HX711_1: Main (J6.2 J7.2), HX711_1 (HX711_1.12)
HX711_2: Main (J6.4 J7.4), HX711_3 (HC711_3.12)
HX711_3: Main (J6.6 J7.6), HX711_2 (HX711_2.12)
PD_SCK: Main (J7.3), HX711_1 (HX711_1.11), HX711_2 (HX711_2.11), HX711_3 (HC711_3.11)